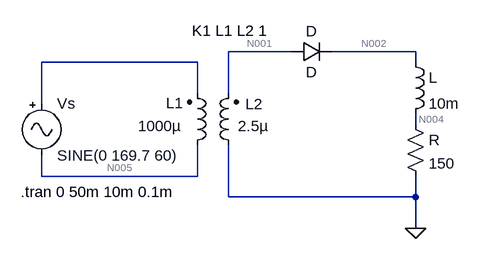
[diagram p0: schematic Half_Wave_Rectifier.asc]
Half_Wave_Rectifier.asc, the LTspice schematic file:
Version 4
SHEET 1 880 680
WIRE 272 -16 176 -16
WIRE 464 -16 336 -16
WIRE 128 0 -112 0
WIRE 464 0 464 -16
WIRE 128 48 128 0
WIRE 176 48 176 -16
WIRE -112 64 -112 0
WIRE 464 96 464 80
WIRE -112 176 -112 144
WIRE 128 176 128 128
WIRE 128 176 -112 176
WIRE 176 208 176 128
WIRE 464 208 464 176
WIRE 464 208 176 208
WIRE 464 256 464 208
FLAG 464 256 0
SYMBOL ind2 112 144 M180
WINDOW 0 -32 81 Left 2
WINDOW 3 -75 45 Left 2
SYMATTR InstName L1
SYMATTR Value 1000µ
SYMATTR SpiceLine Rser=0.01
SYMBOL ind2 192 144 R180
WINDOW 0 -37 79 Left 2
WINDOW 3 -46 45 Left 2
SYMATTR InstName L2
SYMATTR Value 2.5µ
SYMBOL Misc\\signal -112 48 R0
WINDOW 123 0 0 Left 0
WINDOW 39 0 0 Left 0
SYMATTR InstName Vs
SYMATTR Value SINE(0 169.7 60)
SYMBOL res 448 80 R0
SYMATTR InstName R
SYMATTR Value 150
SYMBOL diode 272 0 R270
WINDOW 0 32 32 VTop 2
WINDOW 3 0 32 VBottom 2
SYMATTR InstName D
SYMBOL ind 448 -16 R0
SYMATTR InstName L
SYMATTR Value 10m
TEXT 120 -48 Left 2 !K1 L1 L2 1
TEXT -144 200 Left 2 !.tran 0 50m 10m 0.1m

The netlist it stands for:
* Half_Wave_Rectifier.asc
L1 N005 N003 1000µ Rser=0.01
L2 0 N001 2.5µ
Vs N003 N005 SINE(0 169.7 60)
R N004 0 150
D N001 N002 D
L N002 N004 10m
.model D D
.lib standard.dio
K1 L1 L2 1
.tran 0 50m 10m 0.1m
.backanno
.end

* Results of the author's LTspice run, read from the files saved beside the schematic
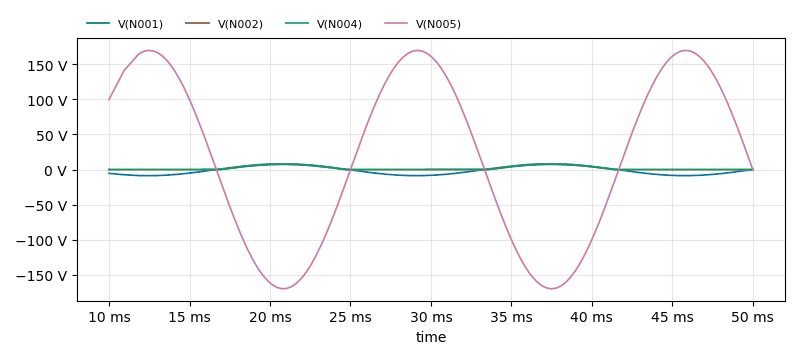
[diagram p1: Transient Analysis of Half_Wave_Rectifier.asc, plotted from the saved traces]
* Transient Analysis, 1 run:
*   V(N001): min -8.677 V, max 8.323 V, average -1.172 V, rms 6.111 V, last 88.49 mV
*   V(N002): min -141 mV, max 7.566 V, average 1.882 V, rms 3.344 V, last 0 V
*   V(N004): min 0 V, max 7.565 V, average 1.882 V, rms 3.343 V, last 0 V
*   V(N005): min -169.7 V, max 169.7 V, average 20.28 V, rms 121.8 V, last 0 V